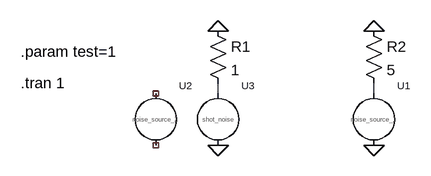
[diagram p0: schematic test.asc]
test.asc, the LTspice schematic file:
Version 4
SHEET 1 1340 680
WIRE 432 368 432 352
WIRE 672 368 672 352
FLAG 432 448 0
FLAG 432 272 0
FLAG 672 448 0
FLAG 672 272 0
SYMBOL Res 416 256 R0
SYMATTR InstName R1
SYMATTR Value 1
SYMBOL noise_source_1 672 368 R0
SYMATTR InstName U1
SYMBOL noise_source_2 336 368 R0
SYMATTR InstName U2
SYMBOL Res 656 256 R0
SYMATTR InstName R2
SYMATTR Value 5
SYMBOL shot_noise 432 368 R0
SYMATTR InstName U3
TEXT 128 352 Left 2 !.tran 1
TEXT 128 304 Left 2 !.param test=1

The netlist it stands for:
* test.asc
R1 0 N001 1
XU1 N002 0 noise_source_1  ; pins in out
XU2 NC_01 NC_02 noise_source_2  ; pins in out
R2 0 N002 5
XU3 N001 0 shot_noise  ; pins in out
.tran 1
.param test=1
.lib noise/pynoise.lib
.backanno
.end